# EAGLE design Master System II Rgb (EAGLE 9.4.0)
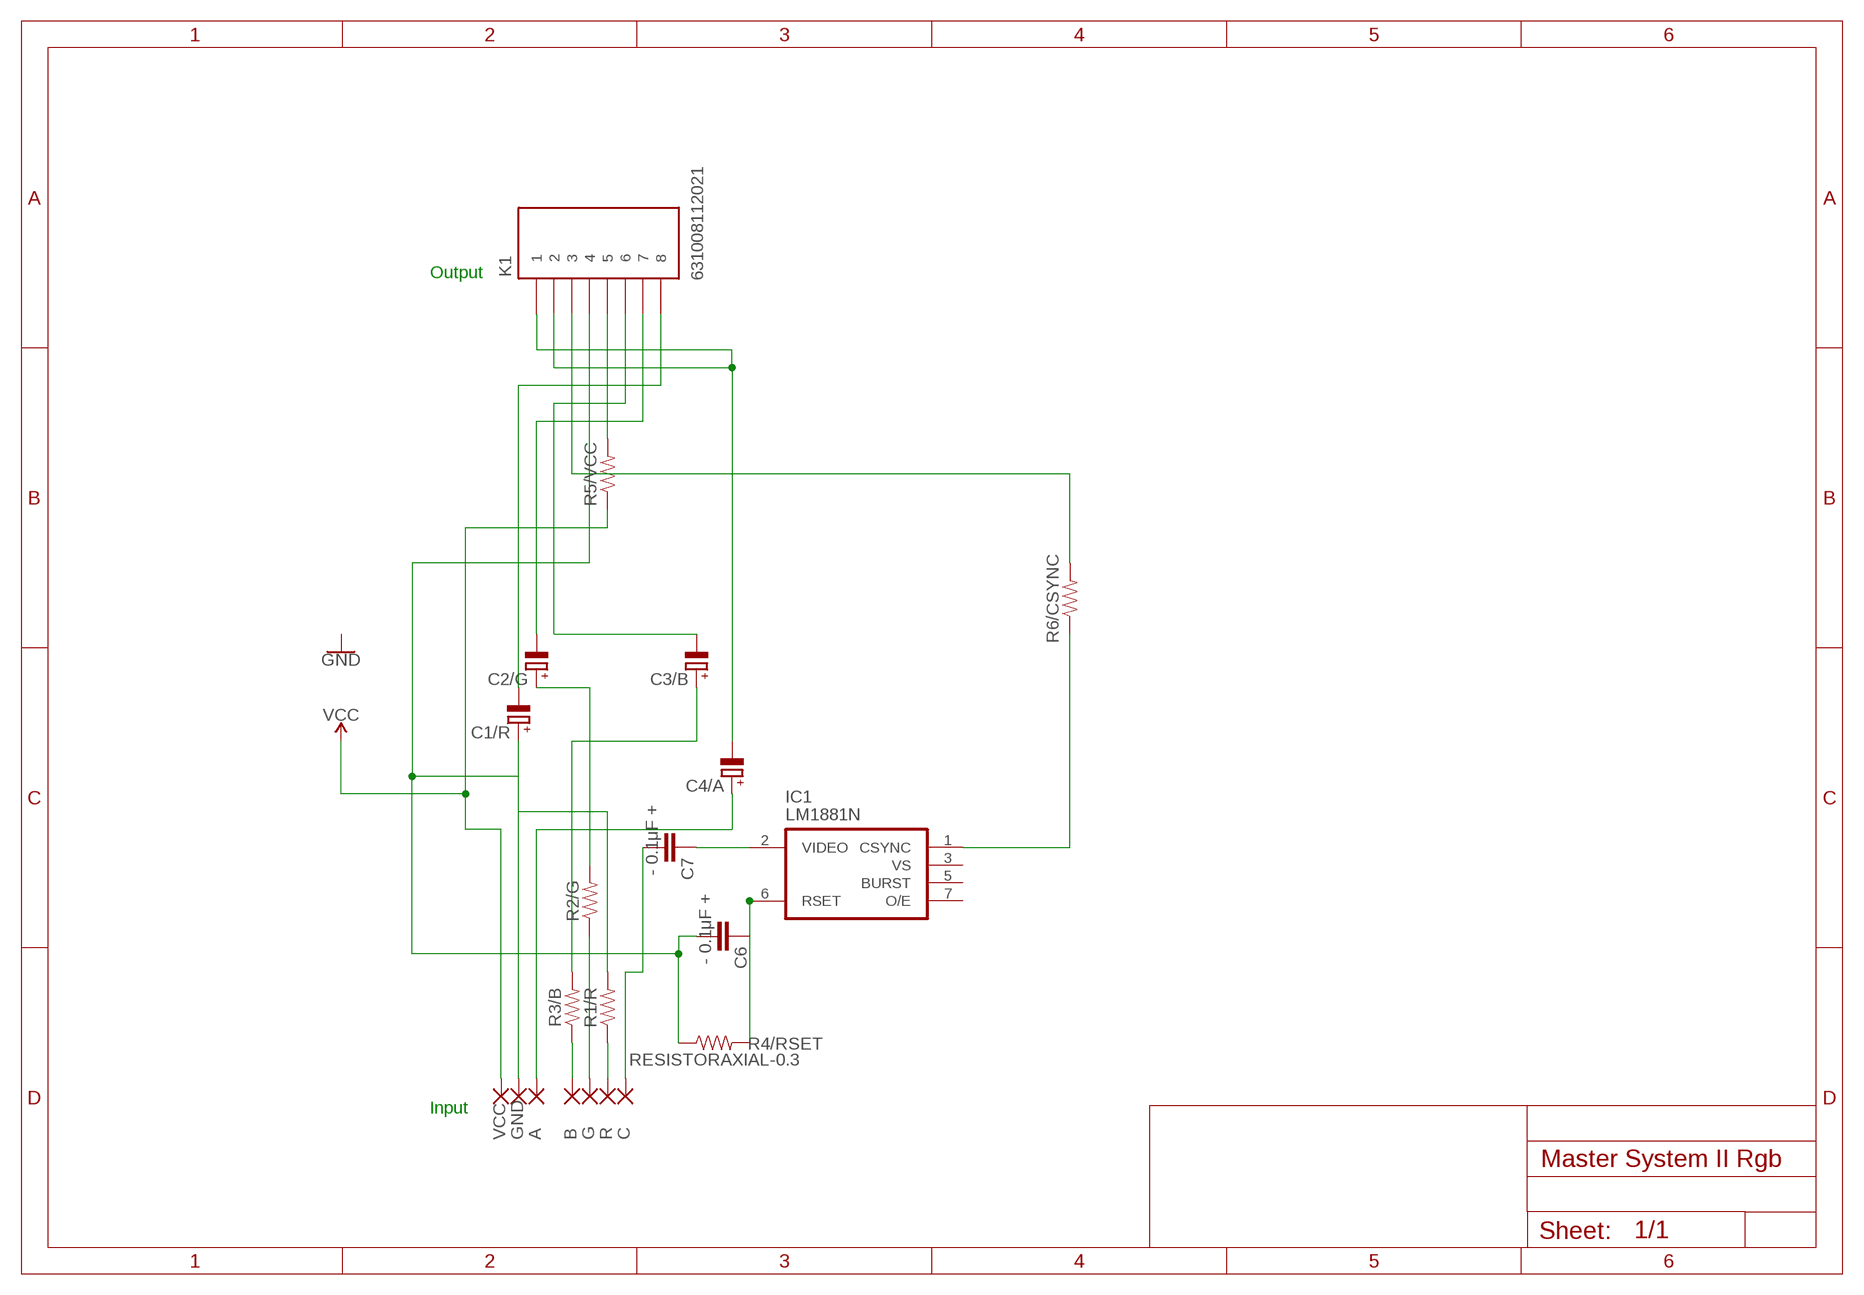
[diagram p0: schematic, sheet 1]

## Parts
A  WIREPADSMD2,54-5,08  [SMD2,54-5,08]
B  WIREPADSMD2,54-5,08  [SMD2,54-5,08]
C  WIREPADSMD2,54-5,08  [SMD2,54-5,08]
C1/R  CPOL-EUE2.5-6  [E2,5-6]
C2/G  CPOL-EUE2.5-6  [E2,5-6]
C3/B  CPOL-EUE2.5-6  [E2,5-6]
C4/A  CPOL-EUE2.5-6  [E2,5-6]
C6  - 0.1μF +  22PF-PTH-2.54MM-200V-5%  [CAP-PTH-2.54]
C7  - 0.1μF +  22PF-PTH-2.54MM-200V-5%  [CAP-PTH-2.54]
G  WIREPADSMD2,54-5,08  [SMD2,54-5,08]
GND  WIREPADSMD2,54-5,08  [SMD2,54-5,08]
IC1  LM1881N  [DIL08]
K1  631008112021  [631008112021]
R  WIREPADSMD2,54-5,08  [SMD2,54-5,08]
R1/R  RESISTORAXIAL-0.3  [AXIAL-0.3]
R2/G  RESISTORAXIAL-0.3  [AXIAL-0.3]
R3/B  RESISTORAXIAL-0.3  [AXIAL-0.3]
R4/RSET  RESISTORAXIAL-0.3  [AXIAL-0.3]
R5/VCC  RESISTORAXIAL-0.3  [AXIAL-0.3]
R6/CSYNC  RESISTORAXIAL-0.3  [AXIAL-0.3]
VCC  WIREPADSMD2,54-5,08  [SMD2,54-5,08]

## Nets
N$1: C6.2 GND.1(P) K1.7 R4/RSET.P$1
N$2: C4/A.- K1.1 K1.2
N$3: C1/R.+ R1/R.P$2
N$4: C1/R.- K1.6
N$5: C2/G.+ R2/G.P$2
N$6: C2/G.- K1.4
N$7: C3/B.+ R3/B.P$2
N$8: C3/B.- K1.8
N$9: A.1(P) C4/A.+
N$10: IC1.1(CSYNC) R6/CSYNC.P$1
N$11: C7.2 C.1(P)
N$12: K1.3 R5/VCC.P$2
N$16: R1/R.P$1 R.1(P)
N$17: C6.1 IC1.6(RSET) R4/RSET.P$2
N$18: G.1(P) R2/G.P$1
N$19: B.1(P) R3/B.P$1
N$20: K1.5 R6/CSYNC.P$2
N$21: C7.1 IC1.2(VIDEO)
VCC: R5/VCC.P$1 VCC.1(P)
Unconnected: IC1.3(VS) IC1.5(BURST) IC1.7(O/E)

## Notes on the sheet
- Output
- Input

## Power pins joined to a net without a drawn wire
GND: IC1.4(GND)
VCC: IC1.8(VCC)

## Library data of the parts
A B C G GND R VCC = wirepad:WIREPAD: Wire PAD connect wire on PCB
C1/R C2/G C3/B C4/A = rcl:CPOL-EU: POLARIZED CAPACITOR, European symbol; SPICEPREFIX: C
C6 C7 = SparkFun-Capacitors:22PF: 22pF ceramic capacitors A capacitor is a passive two-terminal electrical component used to store electrical energy temporarily in an electric field.; PROD_ID: CAP-09128; VALUE: 22pF
IC1 = oldchips2:LM1881: Video sync separator
K1 = Wuerth_Elektronik_eiCan_Communication_Connectors_v2.2:631008112021: WR-COM Horizontal Shielded Mini DIN, 8 pins
R1/R R2/G R3/B R4/RSET R5/VCC R6/CSYNC = SparkFun-Resistors:RESISTOR: Generic Resistor Package

## Board
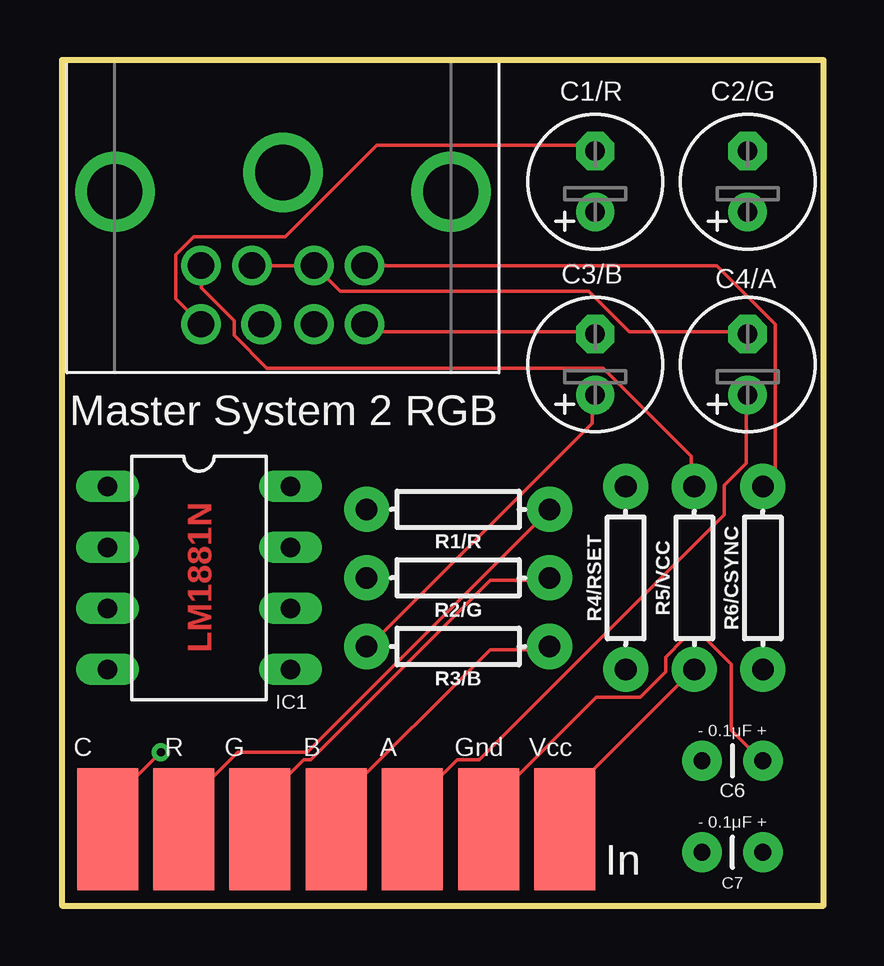
[diagram p1: board, top side]
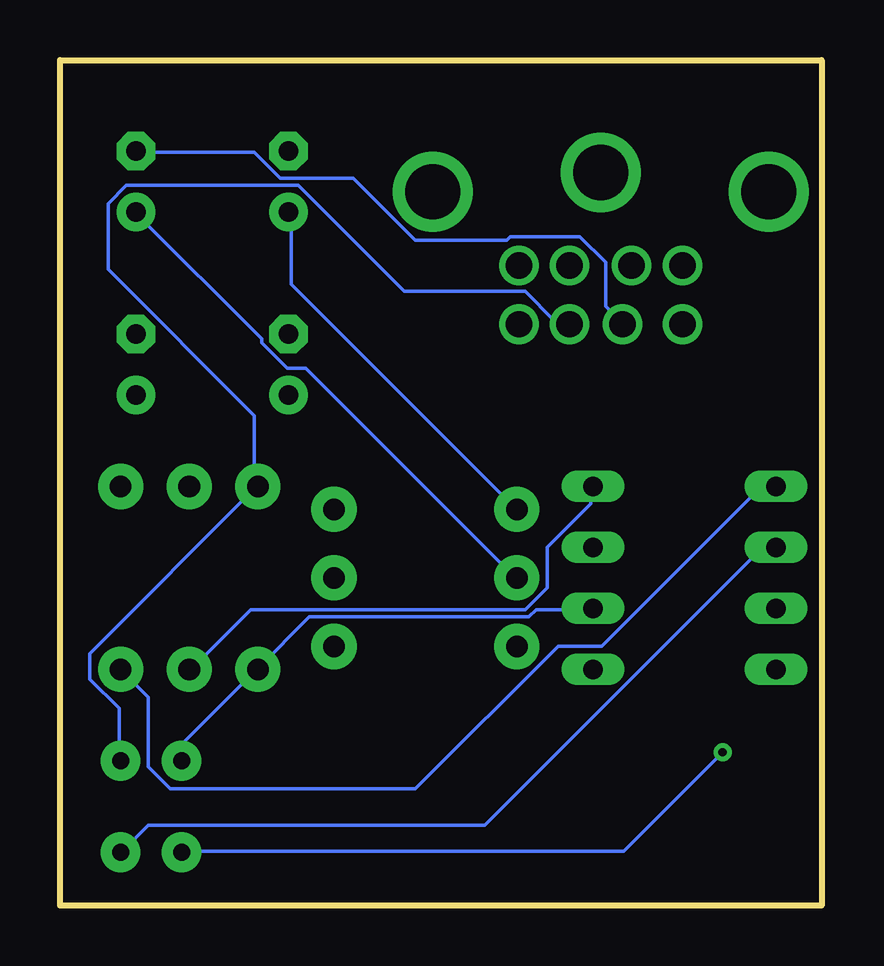
[diagram p2: board, bottom side, seen from below]

Size 31.74 x 35.23 mm. Coordinates in mm from the lower left corner, seen from the top.
Outline: 0,0 31.74,0 31.74,35.23 0,35.23 0,0
Copper layers (1*16): Top 0.035mm / dielectric 1.5mm / Bottom 0.035mm
Design rules "default": minimum track width 6mil, minimum drill 0.35mm, track to track 6mil, track to pad 6mil, pad to pad 6mil, via to via 6mil, smd to smd 6mil, copper to edge 40mil, drill to drill 6mil, minimum pad ring 10mil, minimum via ring 8mil, stop-mask expansion 4mil, vias tented up to drill 0mil, thermal gap 10mil

### Footprints (pad centres in the part's own frame; a part is rotated, then mirrored left to right if it is on the bottom)
SMD2,54-5,08 = smd 2.54 x 5.08: 1 0,0
E2,5-6 = drill 0.813 pad 1.6: + -1.27,0 | drill 0.813 pad 1.6 octagon: - 1.27,0
CAP-PTH-2.54 = drill 0.7 pad 1.651: 1 -1.27,0; 2 1.27,0
DIL08 = drill 0.813 long: 1 -3.81,-3.81; 2 -1.27,-3.81; 3 1.27,-3.81; 4 3.81,-3.81; 5 3.81,3.81; 6 1.27,3.81; 7 -1.27,3.81; 8 -3.81,3.81
631008112021 = drill 1.1: 1 -1.29,-8.57; 2 1.3,-8.57; 3 -3.405,-8.57; 4 -0.9,-11.02; 5 3.405,-8.57; 6 -3.405,-11.02; 7 1.3,-11.02; 8 3.405,-11.02 | drill 2.3: Z1 0,-4.7; Z2 -7,-5.5; Z3 7,-5.5
AXIAL-0.3 = drill 0.9 pad 1.88: P$1 -3.81,0; P$2 3.81,0

### Placement (x,y rotation side)
A  14.6,3.18 0 top
B  11.43,3.18 0 top
C  1.9,3.18 0 top
C1/R  22.23,30.16 90 top
C2/G  28.57,30.16 90 top
C3/B  22.23,22.54 90 top
C4/A  28.57,22.54 90 top
C6  27.94,6.03 0 top
C7  27.94,2.22 180 top
G  8.25,3.18 0 top
GND  17.78,3.18 0 top
IC1  5.71,13.65 270 top
K1  9.21,35.24 0 top
R  5.08,3.18 0 top
R1/R  16.51,16.51 180 top
R2/G  16.51,13.65 180 top
R3/B  16.51,10.8 180 top
R4/RSET  23.49,13.65 270 top
R5/VCC  26.35,13.65 90 top
R6/CSYNC  29.21,13.65 90 top
VCC  20.95,3.18 0 top

### Tracks (layer width: path | path; a pad name or v marks a point on that pad's centre or on a via)
N$1
  Top 0.152: GND.1 17.84,3.19 17.84,4.25 22.26,8.67 24.09,8.67 25.16,9.74 25.16,10.35 25.92,11.11 26.84,11.11 27.9,10.05 27.9,7.3 29.12,6.08 C6.2
  Bottom 0.152: K1.7 10.53,24.37 11.14,24.37 12.36,25.59 17.39,25.59 21.81,30.01 28.97,30.01 29.73,29.25 29.73,26.5 23.63,20.41 23.63,17.51 R4/RSET.P$1 23.63,17.36 30.49,10.5 30.49,9.44 29.27,8.22 29.27,6.08 C6.2
N$2
  Top 0.152: C4/A.- 28.51,23.91 23.63,23.91 21.96,25.59 11.6,25.59 10.53,26.66 K1.2 10.38,26.66 7.94,26.66 K1.1
N$3
  Bottom 0.152: C1/R.+ 22.11,28.79 22.11,25.9 12.81,16.6 R1/R.P$2
N$4
  Top 0.152: C1/R.- 21.94,31.69 13.12,31.69 9.31,27.88 5.5,27.88 4.74,27.11 4.74,25.29 5.65,24.37 K1.6
N$5
  Bottom 0.152: C2/G.+ 28.51,28.79 23.33,23.61 23.33,23.46 22.26,22.39 21.5,22.39 12.81,13.7 R2/G.P$2
N$6
  Bottom 0.152: C2/G.- 28.51,31.38 23.63,31.38 22.57,30.31 19.52,30.31 16.93,27.72 13.12,27.72 12.97,27.88 10.07,27.88 9,26.81 9,24.98 8.39,24.37 K1.4
N$7
  Top 0.152: C3/B.+ 22.11,21.17 22.11,20.1 12.81,10.81 R3/B.P$2
N$8
  Top 0.152: C3/B.- 22.11,23.91 12.97,23.91 12.66,24.22 K1.8
N$9
  Top 0.152: C4/A.+ 28.51,21.17 28.51,18.43 27.6,17.51 27.6,16.29 17.39,6.08 16.47,6.08 14.64,4.25 14.64,3.19 A.1
N$10
  Bottom 0.152: IC1.1 1.99,17.36 2.6,17.36 9.16,10.81 10.99,10.81 16.93,4.86 27.14,4.86 28.05,5.78 28.05,8.67 29.12,9.74 R6/CSYNC.P$1
N$11  (via drill 0.35)
  Top 0.152: v4.13,6.39 1.99,4.25 1.99,3.19 C.1
  Bottom 0.152: v4.13,6.39 8.24,2.27 26.53,2.27 C7.2
N$12
  Top 0.152: K1.3 5.8,26.66 5.8,25.74 7.18,24.37 7.18,23.76 8.55,22.39 22.57,22.39 26.23,18.73 26.23,17.51 R5/VCC.P$2
N$16
  Top 0.152: R1/R.P$1 20.28,16.45 10.22,6.39 7.33,6.39 5.19,4.25 5.19,3.19 R.1
N$17
  Bottom 0.152: IC1.6 9.61,12.33 11.9,12.33 12.2,12.03 21.35,12.03 23.48,9.89 R4/RSET.P$2 23.63,9.74 26.53,6.85 26.53,6.08 C6.1
N$18
  Top 0.152: R2/G.P$1 20.28,13.55 17.84,13.55 10.38,6.08 10.07,6.08 8.39,4.41 8.39,3.19 G.1
N$19
  Top 0.152: R3/B.P$1 20.28,10.66 17.84,10.66 11.44,4.25 11.44,3.19 B.1
N$20
  Top 0.152: K1.5 12.66,26.66 27.29,26.66 29.73,24.22 29.73,17.97 29.27,17.51 R6/CSYNC.P$2
N$21
  Bottom 0.152: IC1.2 2.45,14.92 14.03,3.34 28.05,3.34 29.12,2.27 C7.1
VCC
  Top 0.152: VCC.1 21.04,3.19 21.04,4.56 26.23,9.74 R5/VCC.P$1
  Bottom 0.152: IC1.8 9.61,17.36 9.61,16.75 11.44,14.92 11.44,13.25 12.36,12.33 23.79,12.33 26.23,9.89 R5/VCC.P$1

### Text on the board
tNames: Master System 2 RGB | C | R | G | B | A | Gnd | Vcc | In